# Altium schematic sheet 011_SoC RMII & SPE PHY.SchDoc
size 420 x 297 mm; Page Create Date: May 29, 2006; WebSite: https://www.seeedstudio.com; Variant Name: <Core Design>; Page Number: 11; Drawing: qxn; Schematic Name: BeaglePlay; Page Size: A3; Comment: Seeed Title; Page Count: 22; Page Name: 011_SoC RMII & SPE PHY; Company: Seeed Studio; RevCode: v0.2; DsnPath: C:\Users\a0488739\Documents\GitHub\beagleplay\allegro\DVT\BEAGLEPLAYV020_220915.DSN; SchematicName: BeaglePlay; PageName: 011_SoC RMII & SPE PHY; PageSize: A3; TopSchematic: True
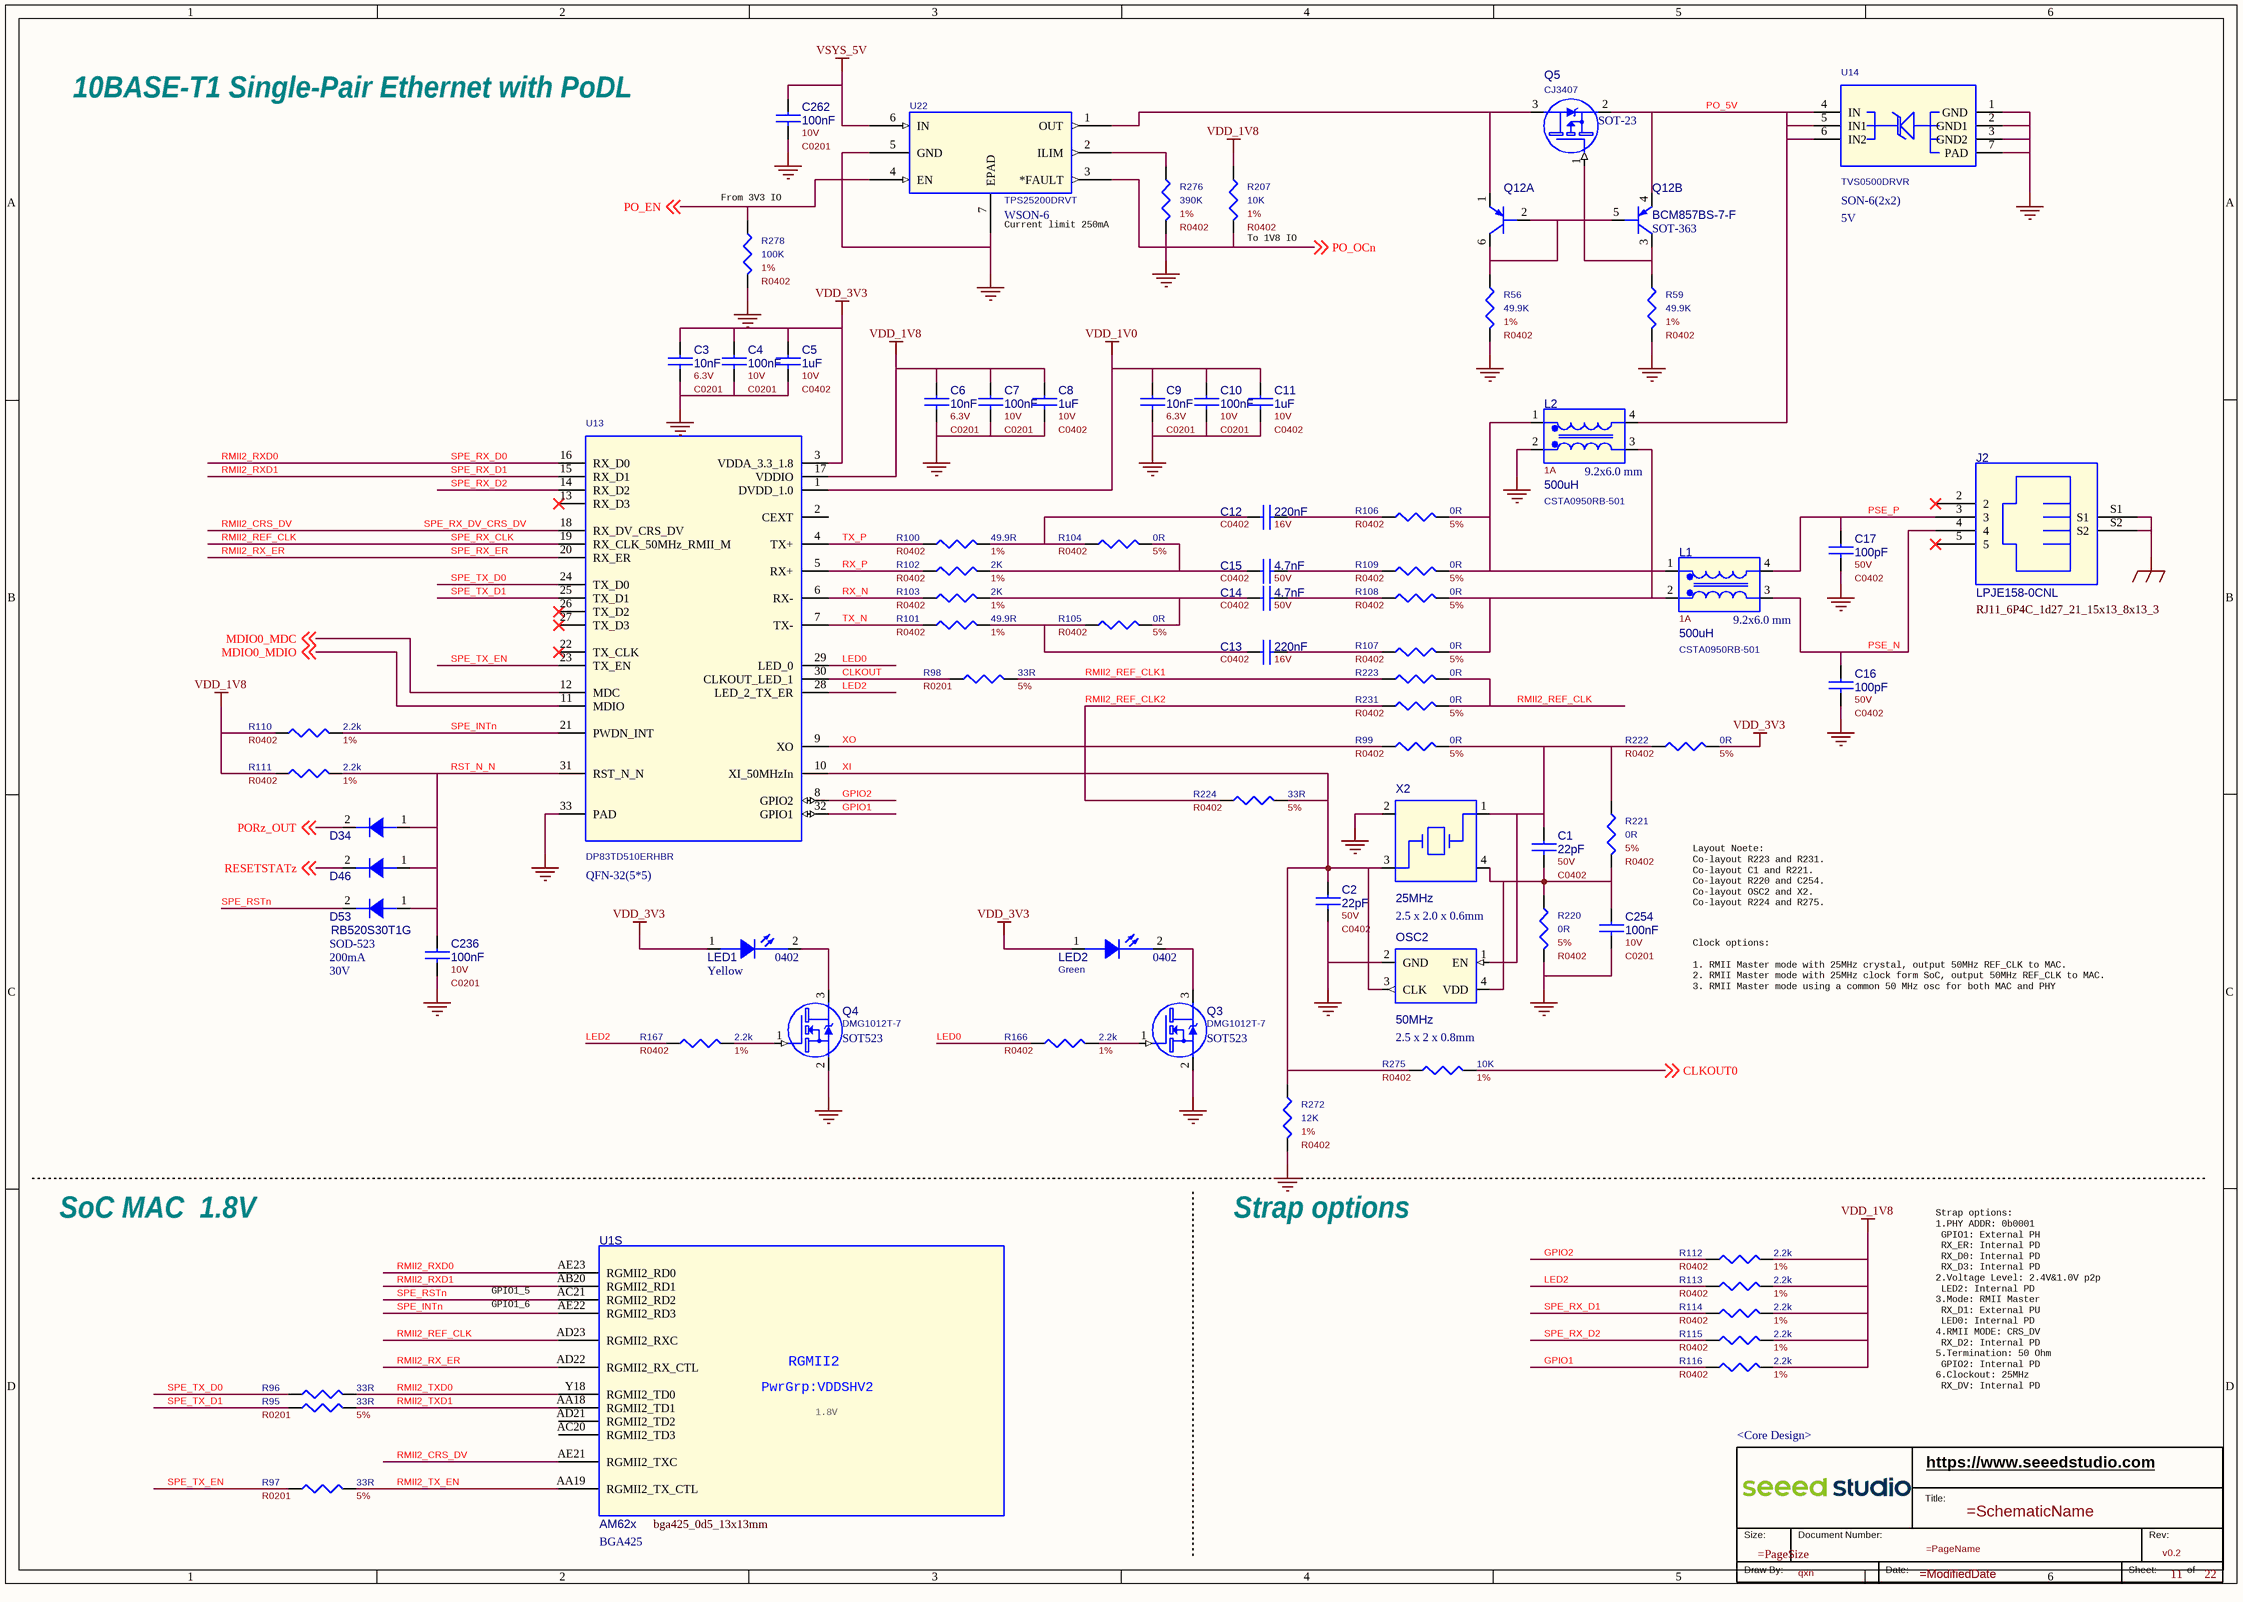
[diagram p0: 011_SoC RMII & SPE PHY.SchDoc]

## Parts
*  RevCode: v0.2  Page Number: 11  Page Count: 22  Drawing: qxn  Variant Name: <Core Design>  (hidden comment: Seeed Title)  (graphical)
C1  value 22pF  Rating: 50V  [C0402]  (hidden comment: CC)
C2  value 22pF  Rating: 50V  [C0402]  (hidden comment: CC)
C3  value 10nF  Rating: 6.3V  [C0201]  (hidden comment: CC)
C4  value 100nF  Rating: 10V  [C0201]  (hidden comment: CC)
C5  value 1uF  Rating: 10V  [C0402]  (hidden comment: CC)
C6  value 10nF  Rating: 6.3V  [C0201]  (hidden comment: CC)
C7  value 100nF  Rating: 10V  [C0201]  (hidden comment: CC)
C8  value 1uF  Rating: 10V  [C0402]  (hidden comment: CC)
C9  value 10nF  Rating: 6.3V  [C0201]  (hidden comment: CC)
C10  value 100nF  Rating: 10V  [C0201]  (hidden comment: CC)
C11  value 1uF  Rating: 10V  [C0402]  (hidden comment: CC)
C12  value 220nF  Rating: 16V  [C0402]  (hidden comment: CC)
C13  value 220nF  Rating: 16V  [C0402]  (hidden comment: CC)
C14  value 4.7nF  Rating: 50V  [C0402]  (hidden comment: CC)
C15  value 4.7nF  Rating: 50V  [C0402]  (hidden comment: CC)
C16  value 100pF  Rating: 50V  [C0402]  (hidden comment: CC)
C17  value 100pF  Rating: 50V  [C0402]  (hidden comment: CC)
C236  value 100nF  Rating: 10V  [C0201]  (hidden comment: CC)
C254  value 100nF  Rating: 10V  [C0201]  (hidden comment: CC)
C262  value 100nF  Rating: 10V  [C0201]  (hidden comment: CC)
D34  D  [sod_523]  (value not drawn)
D46  D  [sod_523]  (value not drawn)
D53  value RB520S30T1G  Package Size: SOD-523  Peak Forward Current: 200mA  Repetitive Reverse Voltage Maximum: 30V  [sod_523]  (hidden comment: D)
J2  value LPJE158-0CNL  [RJ11_6P4C_1d27_21_15x13_8x13_3]  (hidden comment: RJ11_6P4C_SHIELDED)
L1  value 500uH  Rating: 1A  Manufacturer PN: CSTA0950RB-501  Package Size: 9.2x6.0 mm  [L4P_2d54_9_2x6x5mm]  (hidden comment: CLT)
L2  value 500uH  Rating: 1A  Package Size: 9.2x6.0 mm  Manufacturer PN: CSTA0950RB-501  [L4P_2d54_9_2x6x5mm]  (hidden comment: CLT)
LED1  Package Size: 0402  LED Color: Yellow  [led0402]  (hidden comment: Single LED)
LED2  value Green  Package Size: 0402  [led0402]  (hidden comment: Single LED)
OSC2  value 50MHz  Package Size: 2.5 x 2 x 0.8mm  [x4_smd_2_5x2_0mm]  (hidden comment: OSC_4P)
Q3  value DMG1012T-7  Package Size: SOT523  [SOT_523]  (hidden comment: NMOS_123)
Q4  value DMG1012T-7  Package Size: SOT523  [SOT_523]  (hidden comment: NMOS_123)
Q5  value CJ3407  Package Size: SOT-23  [sot23]  (hidden comment: PMOS_123)
Q12  value BCM857BS-7-F  Package Size: SOT-363  [SMini6-F3-B]  (hidden comment: PNPx2_126_453)  (parts A,B of 2)
R56  value 49.9K  Rating: 1%  [R0402]  (hidden comment: R)
R59  value 49.9K  Rating: 1%  [R0402]  (hidden comment: R)
R95  value 33R  Rating: 5%  [R0201]  (hidden comment: R)
R96  value 33R  [R0201]  (hidden comment: R)
R97  value 33R  Rating: 5%  [R0201]  (hidden comment: R)
R98  value 33R  Rating: 5%  [R0201]  (hidden comment: R)
R99  value 0R  Rating: 5%  [R0402]  (hidden comment: R)
R100  value 49.9R  Rating: 1%  [R0402]  (hidden comment: R)
R101  value 49.9R  Rating: 1%  [R0402]  (hidden comment: R)
R102  value 2K  Rating: 1%  [R0402]  (hidden comment: R)
R103  value 2K  Rating: 1%  [R0402]  (hidden comment: R)
R104  value 0R  Rating: 5%  [R0402]  (hidden comment: R)
R105  value 0R  Rating: 5%  [R0402]  (hidden comment: R)
R106  value 0R  Rating: 5%  [R0402]  (hidden comment: R)
R107  value 0R  Rating: 5%  [R0402]  (hidden comment: R)
R108  value 0R  Rating: 5%  [R0402]  (hidden comment: R)
R109  value 0R  Rating: 5%  [R0402]  (hidden comment: R)
R110  value 2.2k  Rating: 1%  [R0402]  (hidden comment: R)
R111  value 2.2k  Rating: 1%  [R0402]  (hidden comment: R)
R112  value 2.2k  Rating: 1%  [R0402]  (hidden comment: R)
R113  value 2.2k  Rating: 1%  [R0402]  (hidden comment: R)
R114  value 2.2k  Rating: 1%  [R0402]  (hidden comment: R)
R115  value 2.2k  Rating: 1%  [R0402]  (hidden comment: R)
R116  value 2.2k  Rating: 1%  [R0402]  (hidden comment: R)
R166  value 2.2k  Rating: 1%  [R0402]  (hidden comment: R)
R167  value 2.2k  Rating: 1%  [R0402]  (hidden comment: R)
R207  value 10K  Rating: 1%  [R0402]  (hidden comment: R)
R220  value 0R  Rating: 5%  [R0402]  (hidden comment: R)
R221  value 0R  Rating: 5%  [R0402]  (hidden comment: R)
R222  value 0R  Rating: 5%  [R0402]  (hidden comment: R)
R223  value 0R  [R0402]  (hidden comment: R)
R224  value 33R  Rating: 5%  [R0402]  (hidden comment: R)
R231  value 0R  Rating: 5%  [R0402]  (hidden comment: R)
R272  value 12K  Rating: 1%  [R0402]  (hidden comment: R)
R275  value 10K  Rating: 1%  [R0402]  (hidden comment: R)
R276  value 390K  Rating: 1%  [R0402]  (hidden comment: R)
R278  value 100K  Rating: 1%  [R0402]  (hidden comment: R)
U1  value AM62x  Package Size: BGA425  [bga425_0d5_13x13mm]  (hidden comment: AM62x_BGA425)  (part S of 19)
U13  value DP83TD510ERHBR  Package Size: QFN-32(5*5)  [vqfn32_0d5_5x5mm]  (hidden comment: DP83TD510ERHB)
U14  Package Size: SON-6(2x2)  Rated Voltage: 5V  [WSON6_0d65_2x2x0_8mm]  (hidden comment: TVS0500DRVR)
U22  value TPS25200DRVT  Package Size: WSON-6  [WSON6_0d65_2x2x0_8mm]  (hidden comment: TPS25200DRV)
X2  value 25MHz  Package Size: 2.5 x 2.0 x 0.6mm  [X4-SMD-2_5X2_0X1_0MM]  (hidden comment: XTAL_4P)

## Nets
GND: C2.2 C3.2 C4.2 C5.2 C6.2 C7.2 C8.2 C9.2 C10.2 C11.2 C16.2 C17.2 C236.2 C254.2 C262.2 L2.2 OSC2.2(GND) Q3.2(S) Q4.2(S) R56.2 R59.2 R220.2 R272.2 R276.2 R278.2 U13.33(PAD) U14.1(GND) U14.2(GND1) U14.3(GND2) U14.7(PAD) U22.5(GND) U22.7(EPAD) X2.2
GND_EARTH: J2.S1 J2.S2
VDD_1V0: C9.1 C10.1 C11.1 U13.1(DVDD_1.0)
VDD_1V8: C6.1 C7.1 C8.1 R110.1 R111.1 R112.2 R113.2 R114.2 R115.2 R116.2 R207.1 U13.17(VDDIO)
VDD_3V3: C3.1 C4.1 C5.1 LED1.1(A) LED2.1(A) R222.2 U13.3(VDDA_3.3_1.8)
VSYS_5V: C262.1 U22.6(IN)
CLKOUT: R98.1 U13.30(CLKOUT_LED_1)
CLKOUT0: R275.2 ; off-sheet CLKOUT0
GPIO1: R116.1 U13.32(GPIO1)
GPIO2: R112.1 U13.8(GPIO2)
LED0: R166.1 U13.29(LED_0)
LED2: R113.1 R167.1 U13.28(LED_2_TX_ER)
MDIO0_MDC: U13.12(MDC) ; off-sheet MDIO0_MDC
MDIO0_MDIO: U13.11(MDIO) ; off-sheet MDIO0_MDIO
PO_5V: L2.4 Q5.2(S) Q12.4(E) U14.4(IN) U14.5(IN1) U14.6(IN2)
PO_EN: R278.1 U22.4(EN) ; off-sheet PO_EN
PO_OCn: R207.2 U22.3(*FAULT) ; off-sheet PO_OCn
PORz_OUT: D34.2(C) ; off-sheet PORz_OUT
PSE_N: C16.1 J2.4 L1.3
PSE_P: C17.1 J2.3 L1.4
RESETSTATz: D46.2(C) ; off-sheet RESETSTATz
RMII2_CRS_DV: U1.AE21(RGMII2_TXC) U13.18(RX_DV_CRS_DV)  [also labelled SPE_RX_DV_CRS_DV]
RMII2_REF_CLK: R223.2 R231.2 U1.AD23(RGMII2_RXC) U13.19(RX_CLK_50MHz_RMII_M)  [also labelled SPE_RX_CLK]
RMII2_REF_CLK1: R98.2 R223.1
RMII2_REF_CLK2: R224.1 R231.1
RMII2_RX_ER: U1.AD22(RGMII2_RX_CTL) U13.20(RX_ER)  [also labelled SPE_RX_ER]
RMII2_RXD0: U1.AE23(RGMII2_RD0) U13.16(RX_D0)  [also labelled SPE_RX_D0]
RMII2_RXD1: R114.1 U1.AB20(RGMII2_RD1) U13.15(RX_D1)  [also labelled SPE_RX_D1]
RMII2_TX_EN: R97.2 U1.AA19(RGMII2_TX_CTL)
RMII2_TXD0: R96.2 U1.Y18(RGMII2_TD0)
RMII2_TXD1: R95.2 U1.AA18(RGMII2_TD1)
RST_N_N: C236.1 D34.1(A) D46.1(A) D53.1(A) R111.2 U13.31(RST_N_N)
RX_N: R103.1 U13.6(RX-)
RX_P: R102.1 U13.5(RX+)
SPE_INTn: R110.2 U1.AE22(RGMII2_RD3) U13.21(PWDN_INT)
SPE_RSTn: D53.2(C) U1.AC21(RGMII2_RD2)
SPE_RX_D2: R115.1 U13.14(RX_D2)
SPE_TX_D0: R96.1 U13.24(TX_D0)
SPE_TX_D1: R95.1 U13.25(TX_D1)
SPE_TX_EN: R97.1 U13.23(TX_EN)
TX_N: R101.1 U13.7(TX-)
TX_P: R100.1 U13.4(TX+)
XI: C2.1 OSC2.3(CLK) R224.2 R272.1 R275.1 U13.10(XI_50MHzIn) X2.3
XO: R99.1 U13.9(XO)
NetC1_1: C1.1 OSC2.1(EN) R99.2 R221.1 R222.1 X2.1
NetC1_2: C1.2 C254.1 OSC2.4(VDD) R220.1 R221.2 X2.4
NetC12_1: C12.1 R100.2 R104.1
NetC12_2: C12.2 R106.1
NetC13_1: C13.1 R101.2 R105.1
NetC13_2: C13.2 R107.1
NetC14_1: C14.1 R103.2 R105.2
NetC14_2: C14.2 R108.1
NetC15_1: C15.1 R102.2 R104.2
NetC15_2: C15.2 R109.1
NetL1_1: L1.1 L2.1 R106.2 R109.2
NetL1_2: L1.2 L2.3 R107.2 R108.2
NetLED1_2: LED1.2(C) Q4.3(D)
NetLED2_2: LED2.2(C) Q3.3(D)
NetQ3_1: Q3.1(G) R166.2
NetQ4_1: Q4.1(G) R167.2
NetQ5_1: Q5.1(G) Q12.3(C) R59.1
NetQ5_3: Q5.3(D) Q12.1(E) U22.1(OUT)
NetQ12_2: Q12.2(B) Q12.5(B) Q12.6(C) R56.1
NetR276_1: R276.1 U22.2(ILIM)

Not connected (* = marked no-connect by the designer): J2 2* 5*; U1 AC20(RGMII2_TD3) AD21(RGMII2_TD2); U13 2(CEXT) 13(RX_D3)* 22(TX_CLK)* 26(TX_D2)* 27(TX_D3)*

## Notes on the sheet
- 10BASE-T1 Single-Pair Ethernet with PoDL
- (near R278) From 3V3 IO
- (near U22) Current limit 250mA
- (near R207) To 1V8 IO
- Layout Noete:
  Co-layout R223 and R231.
  Co-layout C1 and R221.
  Co-layout R220 and C254.
  Co-layout OSC2 and X2.
  Co-layout R224 and R275.
- Clock options:
  1. RMII Master mode with 25MHz crystal, output 50MHz REF_CLK to MAC.
  2. RMII Master mode with 25MHz clock form SoC, output 50MHz REF_CLK to MAC.
  3. RMII Master mode using a common 50 MHz osc for both MAC and PHY
- Strap options:
  1.PHY ADDR: 0b0001
  GPIO1: External PH
  RX_ER: Internal PD
  RX_D0: Internal PD
  RX_D3: Internal PD
  2.Voltage Level: 2.4V&1.0V p2p
  LED2: Internal PD
  3.Mode: RMII Master
  RX_D1: External PU
  LED0: Internal PD
  4.RMII MODE: CRS_DV
  RX_D2: Internal PD
  5.Termination: 50 Ohm
  GPIO2: Internal PD
  6.Clockout: 25MHz
  RX_DV: Internal PD
- SoC MAC  1.8V
- Strap options
- GPIO1_5
- GPIO1_6
- 1.8V
- (in symbol AM62x_BGA425, part S) RGMII2; PwrGrp:VDDSHV2
- (in symbol Seeed Title) https://www.seeedstudio.com; Title:; Size:; Document Number:; Rev:; Draw By:; Date:; Sheet:; of

## Library data of the parts
* = Seeed Title: Company: Seeed Studio; WebSite: https://www.seeedstudio.com; Schematic Name: =SchematicName; Page Size: =PageSize; Page Name: =PageName; Page Create Date: May 29, 2006; Page Modify Date: =ModifiedDate
C1 = CC: CAP, Ceramic, SMD, 22pF, 5%, 50V, 0402; Part Reference: C1; Manufacturer PN: CC0402JRNPO9BN220; Manufacturer: YAGEO; Company Part Status: BeagleBone Carrier Board; CLASS: DISCRETE; Temperature Coefficient: NPO; PN: 302010018; PCB Footprint: C0402; Tolerance: 5%; Dielectric Type: Ceramic; Package Size: 0402
C2 = CC: CAP, Ceramic, SMD, 22pF, 5%, 50V, 0402; Part Reference: C2; Company Part Status: BeagleBone Carrier Board; Manufacturer: YAGEO; Manufacturer PN: CC0402JRNPO9BN220; PN: 302010018; Temperature Coefficient: NPO; CLASS: DISCRETE; PCB Footprint: C0402; Package Size: 0402; Dielectric Type: Ceramic; Tolerance: 5%
C3 = CC: CAP, Ceramic, SMD, 10nF, 10%, 6.3V, 0201; Part Reference: C3; Company Part Status: ODYSSEY-i.MX8M; Manufacturer: YAGEO; Manufacturer PN: CC0201KRX5R5BB103; PN: 302011831; Temperature Coefficient: X5R; CLASS: DISCRETE; PCB Footprint: C0201; Package Size: 0201; Dielectric Type: Ceramic; Tolerance: 10%
C4 = CC: CAP, Ceramic, SMD, 100nF, 10%, 10V, 0201; Part Reference: C4; Company Part Status: ODYSSEY-i.MX8M; Manufacturer: YAGEO; Manufacturer PN: CC0201KRX5R6BB104; PN: 302010271; Temperature Coefficient: X5R; CLASS: DISCRETE; PCB Footprint: C0201; Package Size: 0201; Dielectric Type: Ceramic; Tolerance: 10%
C5 = CC: CAP, Ceramic, SMD, 1uF, 10%, 10V, 0402; Part Reference: C5; Company Part Status: BeagleBone Carrier Board; Manufacturer: YAGEO; Manufacturer PN: CC0402KRX5R6BB105; PN: 302010040; Temperature Coefficient: X5R; CLASS: DISCRETE; PCB Footprint: C0402; Package Size: 0402; Dielectric Type: Ceramic; Tolerance: 10%
C6 = CC: CAP, Ceramic, SMD, 10nF, 10%, 6.3V, 0201; Part Reference: C6; Company Part Status: ODYSSEY-i.MX8M; Manufacturer: YAGEO; Manufacturer PN: CC0201KRX5R5BB103; PN: 302011831; Temperature Coefficient: X5R; CLASS: DISCRETE; PCB Footprint: C0201; Package Size: 0201; Dielectric Type: Ceramic; Tolerance: 10%
C7 = CC: CAP, Ceramic, SMD, 100nF, 10%, 10V, 0201; Part Reference: C7; Company Part Status: ODYSSEY-i.MX8M; Manufacturer: YAGEO; Manufacturer PN: CC0201KRX5R6BB104; PN: 302010271; Temperature Coefficient: X5R; CLASS: DISCRETE; PCB Footprint: C0201; Package Size: 0201; Dielectric Type: Ceramic; Tolerance: 10%
C8 = CC: CAP, Ceramic, SMD, 1uF, 10%, 10V, 0402; Part Reference: C8; Company Part Status: BeagleBone Carrier Board; Manufacturer: YAGEO; Manufacturer PN: CC0402KRX5R6BB105; PN: 302010040; Temperature Coefficient: X5R; CLASS: DISCRETE; PCB Footprint: C0402; Package Size: 0402; Dielectric Type: Ceramic; Tolerance: 10%
C9 = CC: CAP, Ceramic, SMD, 10nF, 10%, 6.3V, 0201; Part Reference: C9; Manufacturer PN: CC0201KRX5R5BB103; Manufacturer: YAGEO; Company Part Status: ODYSSEY-i.MX8M; CLASS: DISCRETE; Temperature Coefficient: X5R; PN: 302011831; PCB Footprint: C0201; Tolerance: 10%; Dielectric Type: Ceramic; Package Size: 0201
C10 = CC: CAP, Ceramic, SMD, 100nF, 10%, 10V, 0201; Part Reference: C10; Manufacturer PN: CC0201KRX5R6BB104; Manufacturer: YAGEO; Company Part Status: ODYSSEY-i.MX8M; CLASS: DISCRETE; Temperature Coefficient: X5R; PN: 302010271; PCB Footprint: C0201; Tolerance: 10%; Dielectric Type: Ceramic; Package Size: 0201
C11 = CC: CAP, Ceramic, SMD, 1uF, 10%, 10V, 0402; Part Reference: C11; Manufacturer PN: CC0402KRX5R6BB105; Manufacturer: YAGEO; Company Part Status: BeagleBone Carrier Board; CLASS: DISCRETE; Temperature Coefficient: X5R; PN: 302010040; PCB Footprint: C0402; Tolerance: 10%; Dielectric Type: Ceramic; Package Size: 0402
C12 = CC: CAP, Ceramic, SMD, 220nF, 10%, 16V, 0402; Part Reference: C12; Company Part Status: RT-M7; Manufacturer: YAGEO; Manufacturer PN: CC0402KRX7R7BB224; PN: 302010051; Temperature Coefficient: X7R; CLASS: DISCRETE; PCB Footprint: C0402; Package Size: 0402; Dielectric Type: Ceramic; Tolerance: 10%
C13 = CC: CAP, Ceramic, SMD, 220nF, 10%, 16V, 0402; Part Reference: C13; Company Part Status: RT-M7; Manufacturer: YAGEO; Manufacturer PN: CC0402KRX7R7BB224; PN: 302010051; Temperature Coefficient: X7R; CLASS: DISCRETE; PCB Footprint: C0402; Package Size: 0402; Dielectric Type: Ceramic; Tolerance: 10%
C14 = CC: CAP, Ceramic, SMD, 4.7nF, 10%, 50V, 0402; Part Reference: C14; Manufacturer PN: CC0402KRX7R9BB472; Manufacturer: YAGEO; Company Part Status: MS; CLASS: DISCRETE; Temperature Coefficient: X7R; PN: 302010261; PCB Footprint: C0402; Tolerance: 10%; Dielectric Type: Ceramic; Package Size: 0402
C15 = CC: CAP, Ceramic, SMD, 4.7nF, 10%, 50V, 0402; Part Reference: C15; Manufacturer PN: CC0402KRX7R9BB472; Manufacturer: YAGEO; Company Part Status: MS; CLASS: DISCRETE; Temperature Coefficient: X7R; PN: 302010261; PCB Footprint: C0402; Tolerance: 10%; Dielectric Type: Ceramic; Package Size: 0402
C16 = CC: CAP, Ceramic, SMD, 100pF, 5%, 50V, 0402; Part Reference: C16; Company Part Status: Testo PoE; Manufacturer: YAGEO; Manufacturer PN: CC0402JRNPO9BN101; PN: 302010012; CLASS: DISCRETE; PCB Footprint: C0402; Package Size: 0402; Dielectric Type: Ceramic; Tolerance: 5%
C17 = CC: CAP, Ceramic, SMD, 100pF, 5%, 50V, 0402; Part Reference: C17; Company Part Status: Testo PoE; Manufacturer: YAGEO; Manufacturer PN: CC0402JRNPO9BN101; PN: 302010012; CLASS: DISCRETE; PCB Footprint: C0402; Package Size: 0402; Dielectric Type: Ceramic; Tolerance: 5%
C236 = CC: CAP, Ceramic, SMD, 100nF, 10%, 10V, 0201; Part Reference: C236; Manufacturer PN: CC0201KRX5R6BB104; Manufacturer: YAGEO; Company Part Status: ODYSSEY-i.MX8M; CLASS: DISCRETE; Temperature Coefficient: X5R; PN: 302010271; SIGNAL_MODEL: DEFAULT_CAPACITOR_100000pF_1_2; PCB Footprint: C0201; Tolerance: 10%; Dielectric Type: Ceramic; Package Size: 0201
C254 = CC: CAP, Ceramic, SMD, 100nF, 10%, 10V, 0201; Part Reference: C254; Manufacturer PN: CC0201KRX5R6BB104; Manufacturer: YAGEO; Company Part Status: ODYSSEY-i.MX8M; CLASS: DISCRETE; Temperature Coefficient: X5R; PN: 302010271; SIGNAL_MODEL: DEFAULT_CAPACITOR_100000pF_1_2; PCB Footprint: C0201; Tolerance: 10%; Dielectric Type: Ceramic; Package Size: 0201
C262 = CC: CAP, Ceramic, SMD, 100nF, 10%, 10V, 0201; Part Reference: C262; Manufacturer PN: CC0201KRX5R6BB104; Manufacturer: YAGEO; Company Part Status: ODYSSEY-i.MX8M; CLASS: DISCRETE; Temperature Coefficient: X5R; PN: 302010271; PCB Footprint: C0201; Tolerance: 10%; Dielectric Type: Ceramic; Package Size: 0201
D34 = D: DIO, Schottky, RB520S30T1G, , , , SOD-523; Part Reference: D34; Company Part Status: SCG Vehicle Device; Manufacturer: ON; PN: 304020782; Peak Forward Current: 200mA; Repetitive Reverse Voltage Maximum: 30V; CLASS: DISCRETE; PCB Footprint: sod_523; Value: RB520S30T1G; Package Size: SOD-523; Manufacturer PN: RB520S30T1G
D46 = D: DIO, Schottky, RB520S30T1G, , , , SOD-523; Part Reference: D46; Manufacturer: ON; Company Part Status: SCG Vehicle Device; CLASS: DISCRETE; Repetitive Reverse Voltage Maximum: 30V; Peak Forward Current: 200mA; PN: 304020782; PCB Footprint: sod_523; Value: RB520S30T1G; Manufacturer PN: RB520S30T1G; Package Size: SOD-523
D53 = D: DIO, Schottky, RB520S30T1G, , , , SOD-523; Part Reference: D53; Company Part Status: SCG Vehicle Device; Manufacturer: ON; PN: 304020782; CLASS: DISCRETE; PCB Footprint: sod_523; Manufacturer PN: RB520S30T1G
J2 = RJ11_6P4C_SHIELDED: CONN, RJ11, LPJE158-0CNL, 4+2P, DIP; Part Reference: J2; Company Part Status: JetsonNano Cluster; Manufacturer: LINK-PP; PN: 320140556; CLASS: IO; PCB Footprint: RJ11_6P4C_1d27_21_15x13_8x13_3; Package Size: 4+2P-L21.5*W13.8*H13.3mm; Manufacturer PN: LPJE158-0CNL
L1 = CLT: Common Mode Filter, 500uH, 50 %, 1A, 9.2x6.0 mm; Part Reference: L1; Manufacturer: CODACA; Company Part Status: BeaglePlay; CLASS: DISCRETE; PN: 303050403; PCB Footprint: L4P_2d54_9_2x6x5mm
L2 = CLT: Common Mode Filter, 500uH, 50 %, 1A, 9.2x6.0 mm; Part Reference: L2; Company Part Status: BeaglePlay; Manufacturer: CODACA; PN: 303050403; CLASS: DISCRETE; PCB Footprint: L4P_2d54_9_2x6x5mm
LED1 = Single LED: DIO, LED, Yellow, 20mA, --, --, 0402; Part Reference: LED1; Company Part Status: CM4; Manufacturer: Everlight; Manufacturer PN: 16-213/Y2C-AN2Q1B/3T; PN: 304090746; CLASS: DISCRETE; PCB Footprint: led0402; Value: Yellow; Rated Current: 20mA
LED2 = Single LED: DIO, LED, Green, 20mA, --, --, 0402; Part Reference: LED2; Company Part Status: CM4; Manufacturer: Bright; Manufacturer PN: BL-HGE37A-AV-TRB; PN: 304090121; CLASS: DISCRETE; PCB Footprint: led0402; LED Color: Green; Rated Current: 20mA
OSC2 = OSC_4P: Oscillator, SMD, 24MHz, 30 ppm, --; Part Reference: OSC2; Company Part Status: R2; Manufacturer: SZJPY; Manufacturer PN: JPY2520 24M 3.3V; PN: 306020014; Frequency Tolerance: 30 ppm; CLASS: DISCRETE; PCB Footprint: x4_smd_2_5x2_0mm
Q3 = NMOS_123: XSTR, MOSFET, N-Channel, DMG1012T-7, 20V, 630mA, SOT523, SMD; Part Reference: Q3; Company Part Status: BeagleX; Manufacturer: Diodes; PN: 305030659; CLASS: DISCRETE; PCB Footprint: SOT_523; Polarity: N-Channel; Manufacturer PN: DMG1012T-7
Q4 = NMOS_123: XSTR, MOSFET, N-Channel, DMG1012T-7, 20V, 630mA, SOT523, SMD; Part Reference: Q4; Company Part Status: BeagleX; Manufacturer: Diodes; PN: 305030659; CLASS: DISCRETE; PCB Footprint: SOT_523; Polarity: N-Channel; Manufacturer PN: DMG1012T-7
Q5 = PMOS_123: XSTR, MOSFET, P-Channel, CJ3407, 30V, 4.3A, SOT-23, SMD; Part Reference: Q5; Company Part Status: Sensor Hub; Manufacturer: CJ; PN: 305030010; CLASS: DISCRETE; PCB Footprint: sot23; Polarity: P-Channel; Manufacturer PN: CJ3407
Q12 = PNPx2_126_453: XSTR, BJT, PNP, BCM857BS-7-F, 45 V, 100mA, SOT-363, SMD; Part Reference: Q12; Company Part Status: MS; Manufacturer: Diodes; PN: 305050191; CLASS: DISCRETE; Polarity: PNP; Manufacturer PN: BCM857BS-7-F; PCB Footprint: SMini6-F3-B
R56 = R: RES, Thick Film, 49.9K, 1%, 1/16W, SMD, 0402; Part Reference: R56; Manufacturer PN: RC0402FR-0749K9L; Manufacturer: YAGEO; CLASS: DISCRETE; PN: 301010457; PCB Footprint: R0402; Rated Power: 1/16W; Package Size: 0402
R59 = R: RES, Thick Film, 49.9K, 1%, 1/16W, SMD, 0402; Part Reference: R59; Manufacturer PN: RC0402FR-0749K9L; Manufacturer: YAGEO; CLASS: DISCRETE; PN: 301010457; PCB Footprint: R0402; Rated Power: 1/16W; Package Size: 0402
R95 = R: RES, Thick Film, 33R, 5%, 1/20W, SMD, 0201; Part Reference: R95; Manufacturer PN: RC0201JR-0733RL; Manufacturer: YAGEO; Company Part Status: BeagleBone Carrier Board; CLASS: DISCRETE; PN: 301010675; PCB Footprint: R0201; Rated Power: 1/20W; Package Size: 0201
R96 = R: RES, Thick Film, 33R, 5%, 1/20W, SMD, 0201; Part Reference: R96; Company Part Status: BeagleBone Carrier Board; Manufacturer: YAGEO; Manufacturer PN: RC0201JR-0733RL; PN: 301010675; CLASS: DISCRETE; Rating: 5%; PCB Footprint: R0201; Package Size: 0201; Rated Power: 1/20W
R97 = R: RES, Thick Film, 33R, 5%, 1/20W, SMD, 0201; Part Reference: R97; Manufacturer PN: RC0201JR-0733RL; Manufacturer: YAGEO; Company Part Status: BeagleBone Carrier Board; CLASS: DISCRETE; PN: 301010675; PCB Footprint: R0201; Rated Power: 1/20W; Package Size: 0201
R98 = R: RES, Thick Film, 33R, 5%, 1/20W, SMD, 0201; Part Reference: R98; Company Part Status: BeagleBone Carrier Board; Manufacturer: YAGEO; Manufacturer PN: RC0201JR-0733RL; PN: 301010675; CLASS: DISCRETE; PCB Footprint: R0201; Package Size: 0201; Rated Power: 1/20W
R99 = R: RES, Thick Film, 0R, 5%, 1/16W, SMD, 0402; Part Reference: R99; Company Part Status: BeagleBone Carrier Board; Manufacturer: YAGEO; Manufacturer PN: RC0402JR-070RL; PN: 301010000; CLASS: DISCRETE; PCB Footprint: R0402; Package Size: 0402; Rated Power: 1/16W
R100 = R: RES, Thick Film, 49.9R, 1%, 1/16W, SMD, 0402; Part Reference: R100; Manufacturer PN: RC0402FR-0749R9L; Manufacturer: YAGEO; Company Part Status: BeagleBone Carrier Board; CLASS: DISCRETE; PN: 301010041; PCB Footprint: R0402; Rated Power: 1/16W; Package Size: 0402
R101 = R: RES, Thick Film, 49.9R, 1%, 1/16W, SMD, 0402; Part Reference: R101; Manufacturer PN: RC0402FR-0749R9L; Manufacturer: YAGEO; Company Part Status: BeagleBone Carrier Board; CLASS: DISCRETE; PN: 301010041; PCB Footprint: R0402; Rated Power: 1/16W; Package Size: 0402
R102 = R: RES, Thick Film, 2K, 1%, 1/16 W, SMD, 0402; Part Reference: R102; Manufacturer PN: RC0402FR-072KL; Manufacturer: YAGEO; Company Part Status: CM4 EVB; CLASS: DISCRETE; Rated Power: 1/16 W; Temperature Coefficient: +/-200 ppm; PN: 301010461; PCB Footprint: R0402; Package Size: 0402
R103 = R: RES, Thick Film, 2K, 1%, 1/16 W, SMD, 0402; Part Reference: R103; Manufacturer PN: RC0402FR-072KL; Manufacturer: YAGEO; Company Part Status: CM4 EVB; CLASS: DISCRETE; Rated Power: 1/16 W; Temperature Coefficient: +/-200 ppm; PN: 301010461; PCB Footprint: R0402; Package Size: 0402
R104 = R: RES, Thick Film, 0R, 5%, 1/16W, SMD, 0402; Part Reference: R104; Company Part Status: BeagleBone Carrier Board; Manufacturer: YAGEO; Manufacturer PN: RC0402JR-070RL; PN: 301010000; CLASS: DISCRETE; PCB Footprint: R0402; Package Size: 0402; Rated Power: 1/16W
R105 = R: RES, Thick Film, 0R, 5%, 1/16W, SMD, 0402; Part Reference: R105; Manufacturer PN: RC0402JR-070RL; Manufacturer: YAGEO; Company Part Status: BeagleBone Carrier Board; CLASS: DISCRETE; PN: 301010000; PCB Footprint: R0402; Rated Power: 1/16W; Package Size: 0402
R106 = R: RES, Thick Film, 0R, 5%, 1/16W, SMD, 0402; Part Reference: R106; Company Part Status: BeagleBone Carrier Board; Manufacturer: YAGEO; Manufacturer PN: RC0402JR-070RL; PN: 301010000; CLASS: DISCRETE; PCB Footprint: R0402; Package Size: 0402; Rated Power: 1/16W
R107 = R: RES, Thick Film, 0R, 5%, 1/16W, SMD, 0402; Part Reference: R107; Manufacturer PN: RC0402JR-070RL; Manufacturer: YAGEO; Company Part Status: BeagleBone Carrier Board; CLASS: DISCRETE; PN: 301010000; PCB Footprint: R0402; Rated Power: 1/16W; Package Size: 0402
R108 = R: RES, Thick Film, 0R, 5%, 1/16W, SMD, 0402; Part Reference: R108; Manufacturer PN: RC0402JR-070RL; Manufacturer: YAGEO; Company Part Status: BeagleBone Carrier Board; CLASS: DISCRETE; PN: 301010000; PCB Footprint: R0402; Rated Power: 1/16W; Package Size: 0402
R109 = R: RES, Thick Film, 0R, 5%, 1/16W, SMD, 0402; Part Reference: R109; Manufacturer PN: RC0402JR-070RL; Manufacturer: YAGEO; Company Part Status: BeagleBone Carrier Board; CLASS: DISCRETE; PN: 301010000; PCB Footprint: R0402; Rated Power: 1/16W; Package Size: 0402
R110 = R: RES, Thick Film, 2.2k, 1%, 1/16W, SMD, 0402; Part Reference: R110; Manufacturer PN: RC0402FR-072K2L; Manufacturer: YAGEO; Company Part Status: ST; SIGNAL_MODEL: DEFAULT_RESISTOR_2200OHM_1_2; CLASS: DISCRETE; PN: 301010746; PCB Footprint: R0402; Rated Power: 1/16W; Package Size: 0402
R111 = R: RES, Thick Film, 2.2k, 1%, 1/16W, SMD, 0402; Part Reference: R111; Company Part Status: ST; Manufacturer: YAGEO; Manufacturer PN: RC0402FR-072K2L; PN: 301010746; CLASS: DISCRETE; SIGNAL_MODEL: DEFAULT_RESISTOR_2200OHM_1_2; PCB Footprint: R0402; Package Size: 0402; Rated Power: 1/16W
R112 = R: RES, Thick Film, 2.2k, 1%, 1/16W, SMD, 0402; Part Reference: R112; Manufacturer PN: RC0402FR-072K2L; Manufacturer: YAGEO; Company Part Status: ST; CLASS: DISCRETE; PN: 301010746; SIGNAL_MODEL: DEFAULT_RESISTOR_2200OHM_1_2; PCB Footprint: R0402; Rated Power: 1/16W; Package Size: 0402
R113 = R: RES, Thick Film, 2.2k, 1%, 1/16W, SMD, 0402; Part Reference: R113; Company Part Status: ST; Manufacturer: YAGEO; Manufacturer PN: RC0402FR-072K2L; SIGNAL_MODEL: DEFAULT_RESISTOR_2200OHM_1_2; PN: 301010746; CLASS: DISCRETE; PCB Footprint: R0402; Package Size: 0402; Rated Power: 1/16W
R114 = R: RES, Thick Film, 2.2k, 1%, 1/16W, SMD, 0402; Part Reference: R114; Company Part Status: ST; Manufacturer: YAGEO; Manufacturer PN: RC0402FR-072K2L; SIGNAL_MODEL: DEFAULT_RESISTOR_2200OHM_1_2; PN: 301010746; CLASS: DISCRETE; PCB Footprint: R0402; Package Size: 0402; Rated Power: 1/16W
R115 = R: RES, Thick Film, 2.2k, 1%, 1/16W, SMD, 0402; Part Reference: R115; Company Part Status: ST; Manufacturer: YAGEO; Manufacturer PN: RC0402FR-072K2L; SIGNAL_MODEL: DEFAULT_RESISTOR_2200OHM_1_2; PN: 301010746; CLASS: DISCRETE; PCB Footprint: R0402; Package Size: 0402; Rated Power: 1/16W
R116 = R: RES, Thick Film, 2.2k, 1%, 1/16W, SMD, 0402; Part Reference: R116; Company Part Status: ST; Manufacturer: YAGEO; Manufacturer PN: RC0402FR-072K2L; SIGNAL_MODEL: DEFAULT_RESISTOR_2200OHM_1_2; PN: 301010746; CLASS: DISCRETE; PCB Footprint: R0402; Package Size: 0402; Rated Power: 1/16W
R166 = R: RES, Thick Film, 2.2k, 1%, 1/16W, SMD, 0402; Part Reference: R166; Manufacturer PN: RC0402FR-072K2L; Manufacturer: YAGEO; Company Part Status: ST; CLASS: DISCRETE; PN: 301010746; SIGNAL_MODEL: DEFAULT_RESISTOR_2200OHM_1_2; PCB Footprint: R0402; Rated Power: 1/16W; Package Size: 0402
R167 = R: RES, Thick Film, 2.2k, 1%, 1/16W, SMD, 0402; Part Reference: R167; Manufacturer PN: RC0402FR-072K2L; Manufacturer: YAGEO; Company Part Status: ST; CLASS: DISCRETE; PN: 301010746; SIGNAL_MODEL: DEFAULT_RESISTOR_2200OHM_1_2; PCB Footprint: R0402; Rated Power: 1/16W; Package Size: 0402
R207 = R: RES, Thick Film, 10K, 1%, 1/16W, SMD, 0402; Part Reference: R207; Manufacturer PN: RC0402FR-0710KL; Manufacturer: YAGEO; Company Part Status: BeagleBone Carrier Board; CLASS: DISCRETE; PN: 301010047; PCB Footprint: R0402; Rated Power: 1/16W; Package Size: 0402
R220 = R: RES, Thick Film, 0R, 5%, 1/16W, SMD, 0402; Part Reference: R220; Company Part Status: BeagleBone Carrier Board; Manufacturer: YAGEO; Manufacturer PN: RC0402JR-070RL; PN: 301010000; CLASS: DISCRETE; PCB Footprint: R0402; Package Size: 0402; Rated Power: 1/16W
R221 = R: RES, Thick Film, 0R, 5%, 1/16W, SMD, 0402; Part Reference: R221; Manufacturer PN: RC0402JR-070RL; Manufacturer: YAGEO; Company Part Status: BeagleBone Carrier Board; CLASS: DISCRETE; PN: 301010000; PCB Footprint: R0402; Rated Power: 1/16W; Package Size: 0402
R222 = R: RES, Thick Film, 0R, 5%, 1/16W, SMD, 0402; Part Reference: R222; Manufacturer PN: RC0402JR-070RL; Manufacturer: YAGEO; Company Part Status: BeagleBone Carrier Board; CLASS: DISCRETE; PN: 301010000; PCB Footprint: R0402; Rated Power: 1/16W; Package Size: 0402
R223 = R: RES, Thick Film, 0R, 5%, 1/16W, SMD, 0402; Part Reference: R223; Company Part Status: BeagleBone Carrier Board; Manufacturer: YAGEO; Manufacturer PN: RC0402JR-070RL; PN: 301010000; CLASS: DISCRETE; Rating: 5%; PCB Footprint: R0402; Package Size: 0402; Rated Power: 1/16W
R224 = R: RES, Thick Film, 33R, 5%, 1/16W, SMD, 0402; Part Reference: R224; Company Part Status: BeagleBone Carrier Board; Manufacturer: YAGEO; Manufacturer PN: RC0402JR-0733RL; PN: 301010034; CLASS: DISCRETE; PCB Footprint: R0402; Package Size: 0402; Rated Power: 1/16W
R231 = R: RES, Thick Film, 0R, 5%, 1/16W, SMD, 0402; Part Reference: R231; Manufacturer PN: RC0402JR-070RL; Manufacturer: YAGEO; Company Part Status: BeagleBone Carrier Board; CLASS: DISCRETE; PN: 301010000; PCB Footprint: R0402; Rated Power: 1/16W; Package Size: 0402
R272 = R: RES, Thick Film, 12K, 1%, 1/16W, SMD, 0402; Part Reference: R272; Company Part Status: BeagleBone Carrier Board; Manufacturer: YAGEO; Manufacturer PN: RC0402FR-0712KL; PN: 301010736; CLASS: DISCRETE; PCB Footprint: R0402; Package Size: 0402; Rated Power: 1/16W
R275 = R: RES, Thick Film, 10K, 1%, 1/16W, SMD, 0402; Part Reference: R275; Company Part Status: BeagleBone Carrier Board; Manufacturer: YAGEO; Manufacturer PN: RC0402FR-0710KL; PN: 301010047; CLASS: DISCRETE; PCB Footprint: R0402; Package Size: 0402; Rated Power: 1/16W
R276 = R: RES, Thick Film, 390K, 1%, 1/16W, SMD, 0402; Part Reference: R276; Manufacturer PN: RC0402FR-07390KL; Manufacturer: YAGEO; Company Part Status: R2; CLASS: DISCRETE; PN: 301010774; PCB Footprint: R0402; Rated Power: 1/16W; Package Size: 0402
R278 = R: RES, Thick Film, 100K, 1%, 1/16W, SMD, 0402; Part Reference: R278; Manufacturer PN: RC0402FR-07100KL; Company Part Status: BeagleBone Carrier Board; Manufacturer: YAGEO; CLASS: DISCRETE; PN: 301010456; PCB Footprint: R0402; Rated Power: 1/16W; Package Size: 0402; Temperature: -55¡ãC to 155¡ãC; Status: BeagleBone Carrier Board; Part Type: RES; Manufacturer Part Number: RC0402FR-07100KL
U1 = AM62x_BGA425: IC, Controller, MPU, AM62x, BGA425; Part Reference: U1; Manufacturer PN: AM6254ATCGGHALWR; Manufacturer: TI; Company Part Status: BeaglePlay; PN: 310011537; PCB Footprint: bga425_0d5_13x13mm; CLASS: IC
U13 = DP83TD510E: IC, Interface, Ethernet, DP83TD510ERHBR, QFN-32(5*5); Part Reference: U13; Company Part Status: BeaglePlay; Manufacturer: TI; PN: 310071286; PCB Footprint: vqfn32_0d5_5x5mm; CLASS: IC; Manufacturer PN: DP83TD510ERHBR
U14 = TVS0500DRVR: DIO, TVS, TVS0500DRVR, --, 5V, --, SON-6(2x2); Part Reference: U14; Company Part Status: BeaglePlay; Manufacturer: TI; PN: 304051039; CLASS: DISCRETE; PCB Footprint: WSON6_0d65_2x2x0_8mm; Value: TVS0500DRVR; Manufacturer PN: TVS0500DRVR
U22 = TPS25200DRV: IC, PMIC, eFuse, TPS25200DRVT, WSON-6; Part Reference: U22; Manufacturer: TI; Company Part Status: MS; PN: 310031584; PCB Footprint: WSON6_0d65_2x2x0_8mm; Manufacturer PN: TPS25200DRVT; CLASS: IC
X2 = XTAL_4P: Crystal, SMD, 25MHz, 20 ppm, 18pF; Part Reference: X2; Company Part Status: S5; Manufacturer: Interquip; Manufacturer PN: 5ZAA25000182TFA0Q3; PN: 306011049; Frequency Tolerance: 20 ppm; CLASS: DISCRETE; PCB Footprint: X4-SMD-2_5X2_0X1_0MM